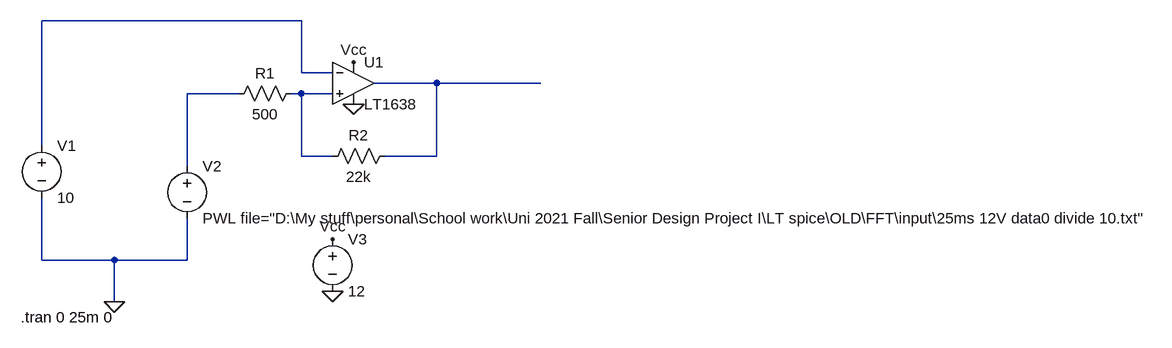
[diagram p0: schematic input filtering with schmitt trigger 2.asc]
input filtering with schmitt trigger 2.asc, the LTspice schematic file:
Version 4
SHEET 1 1972 680
WIRE 368 -96 -32 -96
WIRE 368 -16 368 -96
WIRE 416 -16 368 -16
WIRE 576 0 480 0
WIRE 736 0 576 0
WIRE 272 16 192 16
WIRE 368 16 352 16
WIRE 416 16 368 16
WIRE -32 96 -32 -96
WIRE 368 112 368 16
WIRE 416 112 368 112
WIRE 576 112 576 0
WIRE 576 112 496 112
WIRE 192 128 192 16
WIRE -32 272 -32 176
WIRE 80 272 -32 272
WIRE 192 272 192 208
WIRE 192 272 80 272
WIRE 80 336 80 272
FLAG 80 336 0
FLAG 448 32 0
FLAG 416 240 Vcc
FLAG 416 320 0
FLAG 448 -32 Vcc
SYMBOL voltage -32 80 R0
WINDOW 123 0 0 Left 0
WINDOW 39 0 0 Left 0
SYMATTR InstName V1
SYMATTR Value 10
SYMBOL voltage 192 112 R0
WINDOW 123 0 0 Left 0
WINDOW 39 0 0 Left 0
SYMATTR InstName V2
SYMATTR Value PWL file="D:\My stuff\personal\School work\Uni 2021 Fall\Senior Design Project I\LT spice\OLD\FFT\input\25ms 12V data0 divide 10.txt"
SYMBOL res 368 0 R90
WINDOW 0 0 56 VBottom 2
WINDOW 3 32 56 VTop 2
SYMATTR InstName R1
SYMATTR Value 500
SYMBOL OpAmps\\LT1638 448 -64 R0
SYMATTR InstName U1
SYMBOL voltage 416 224 R0
SYMATTR InstName V3
SYMATTR Value 12
SYMBOL res 512 96 R90
WINDOW 0 0 56 VBottom 2
WINDOW 3 32 56 VTop 2
SYMATTR InstName R2
SYMATTR Value 22k
TEXT -64 360 Left 2 !.tran 0 25m 0

The netlist it stands for:
* input filtering with schmitt trigger 2.asc
V1 N001 0 10
V2 N003 0 PWL file="D:\My stuff\personal\School work\Uni 2021 Fall\Senior Design Project I\LT spice\OLD\FFT\input\25ms 12V data0 divide 10.txt"
R1 N004 N003 500
XU1 N004 N001 Vcc 0 N002 LT1638  ; pins In+ In- V+ V- OUT
V3 Vcc 0 12
R2 N002 N004 22k
.tran 0 25m 0
.backanno
.end